# EAGLE design 60_keyboard (EAGLE 9.6.2)
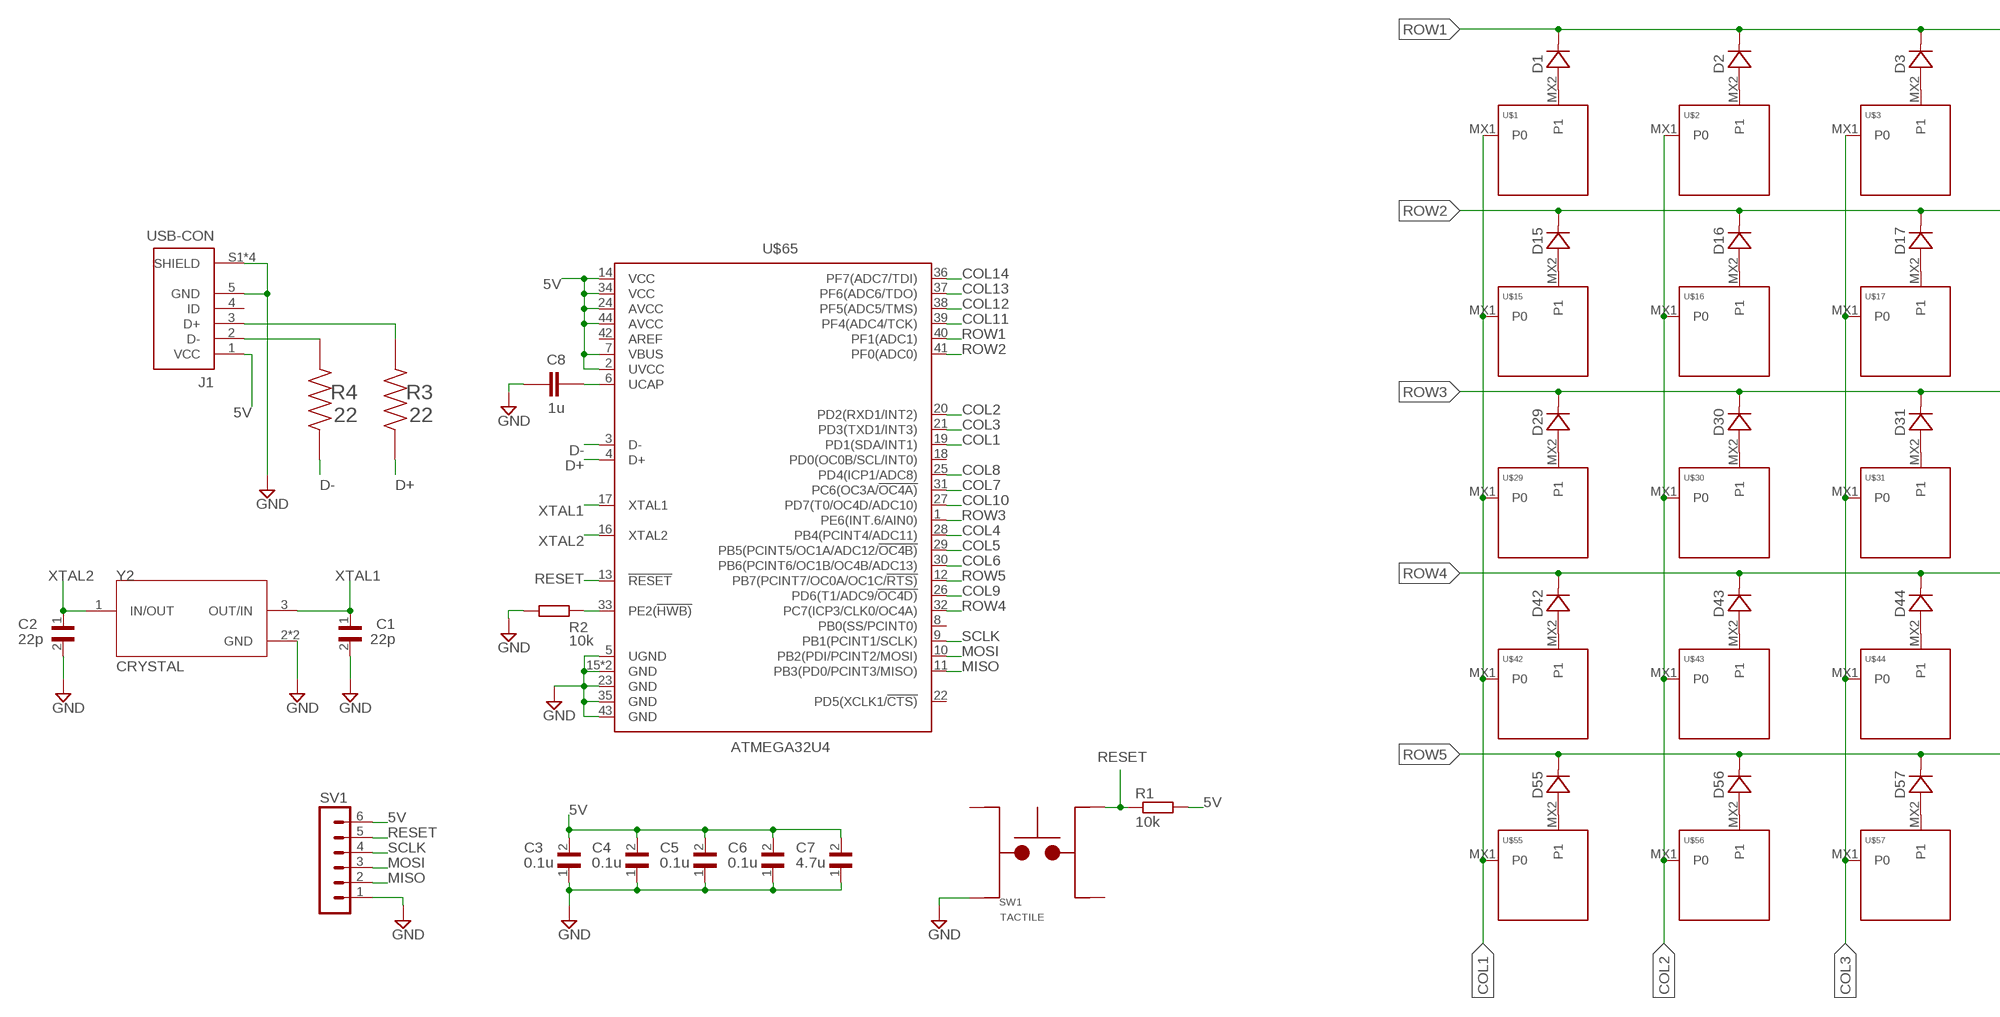
[diagram p0: schematic, sheet 1, part 1 of 2]
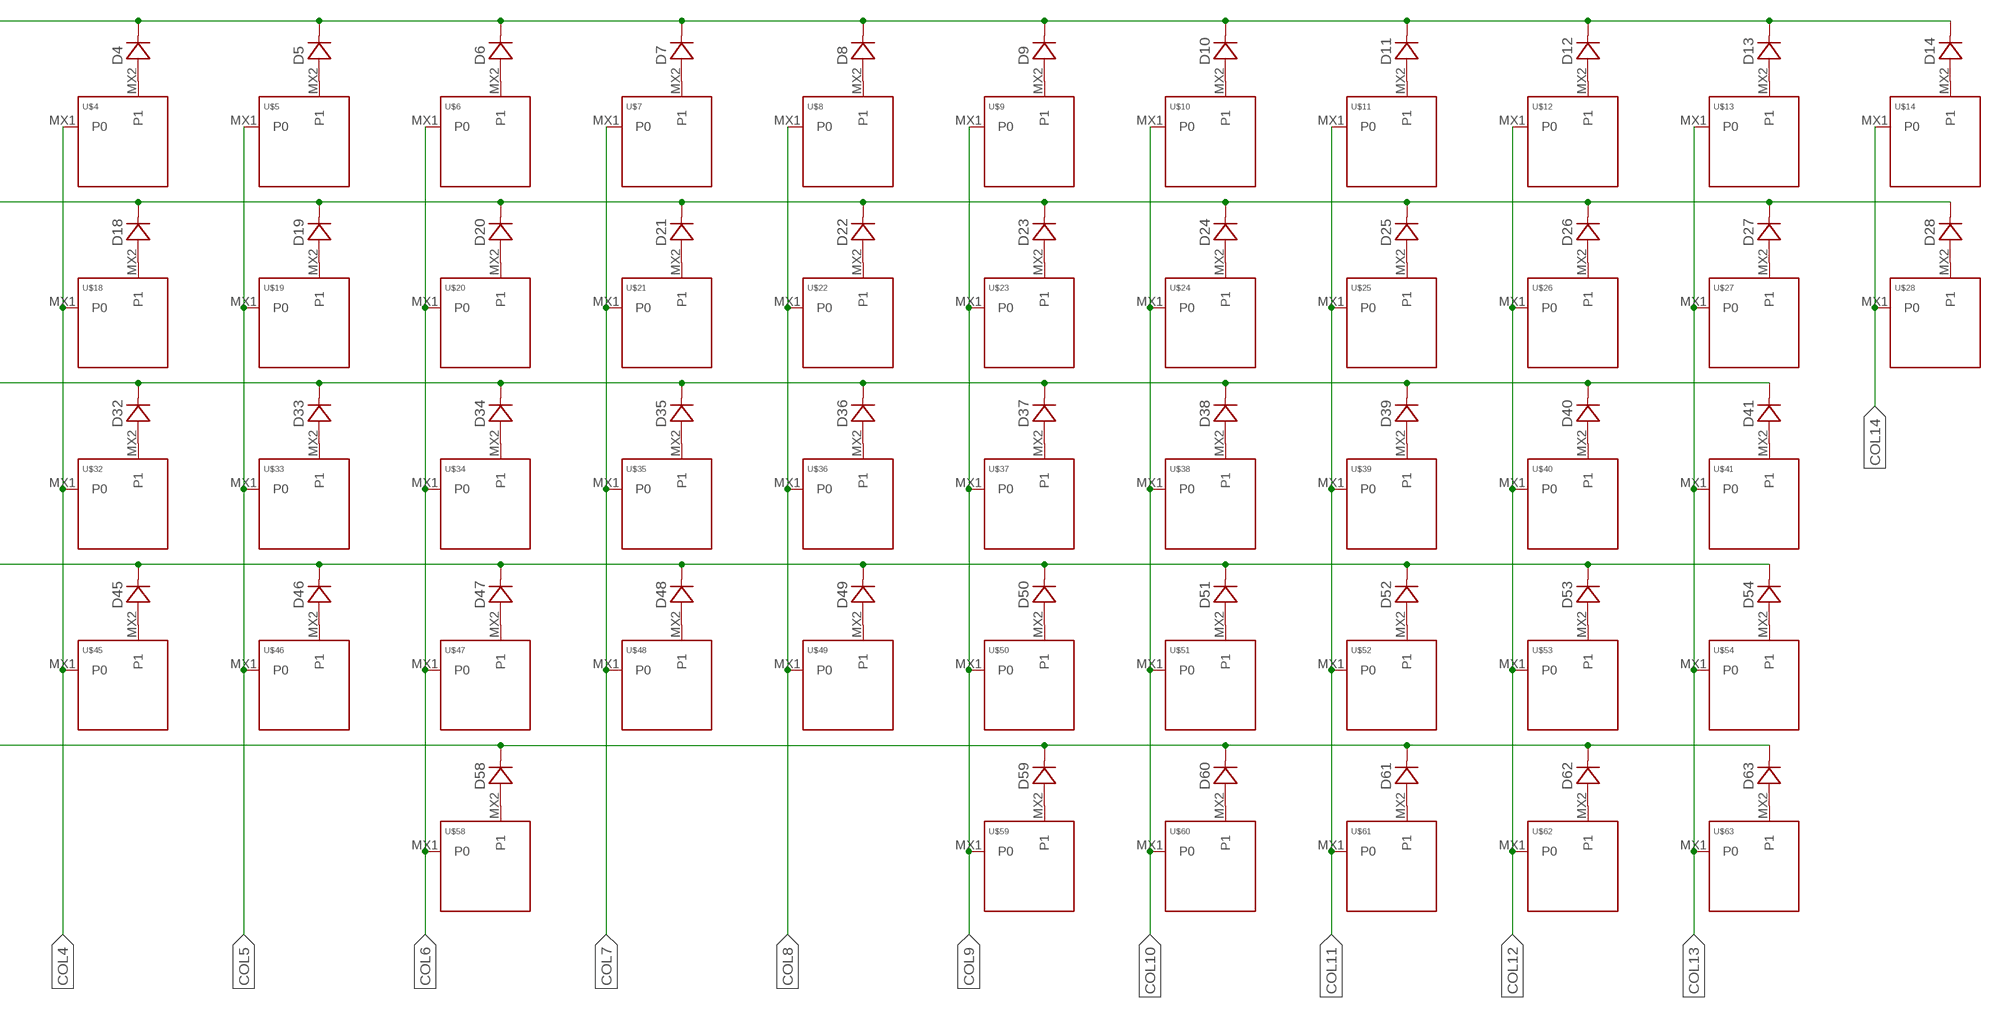
[diagram p1: schematic, sheet 1, part 2 of 2]

## Parts
C1  22p  C0805C220J5GACTU  [CAPC2012X140N]
C2  22p  C0805C220J5GACTU  [CAPC2012X140N]
C3  0.1u  08055F104K4T2A  [CAPC2012X140N]
C4  0.1u  08055F104K4T2A  [CAPC2012X140N]
C5  0.1u  08055F104K4T2A  [CAPC2012X140N]
C6  0.1u  08055F104K4T2A  [CAPC2012X140N]
C7  4.7u  CL21A475KAQNNNE  [CAPC2012X140N]
C8  1u  CAPACITOR-C0805  [C0805]
D1  DIODE-SOD-123  [SOD-123]
D2  DIODE-SOD-123  [SOD-123]
D3  DIODE-SOD-123  [SOD-123]
D4  DIODE-SOD-123  [SOD-123]
D5  DIODE-SOD-123  [SOD-123]
D6  DIODE-SOD-123  [SOD-123]
D7  DIODE-SOD-123  [SOD-123]
D8  DIODE-SOD-123  [SOD-123]
D9  DIODE-SOD-123  [SOD-123]
D10  DIODE-SOD-123  [SOD-123]
D11  DIODE-SOD-123  [SOD-123]
D12  DIODE-SOD-123  [SOD-123]
D13  DIODE-SOD-123  [SOD-123]
D14  DIODE-SOD-123  [SOD-123]
D15  DIODE-SOD-123  [SOD-123]
D16  DIODE-SOD-123  [SOD-123]
D17  DIODE-SOD-123  [SOD-123]
D18  DIODE-SOD-123  [SOD-123]
D19  DIODE-SOD-123  [SOD-123]
D20  DIODE-SOD-123  [SOD-123]
D21  DIODE-SOD-123  [SOD-123]
D22  DIODE-SOD-123  [SOD-123]
D23  DIODE-SOD-123  [SOD-123]
D24  DIODE-SOD-123  [SOD-123]
D25  DIODE-SOD-123  [SOD-123]
D26  DIODE-SOD-123  [SOD-123]
D27  DIODE-SOD-123  [SOD-123]
D28  DIODE-SOD-123  [SOD-123]
D29  DIODE-SOD-123  [SOD-123]
D30  DIODE-SOD-123  [SOD-123]
D31  DIODE-SOD-123  [SOD-123]
D32  DIODE-SOD-123  [SOD-123]
D33  DIODE-SOD-123  [SOD-123]
D34  DIODE-SOD-123  [SOD-123]
D35  DIODE-SOD-123  [SOD-123]
D36  DIODE-SOD-123  [SOD-123]
D37  DIODE-SOD-123  [SOD-123]
D38  DIODE-SOD-123  [SOD-123]
D39  DIODE-SOD-123  [SOD-123]
D40  DIODE-SOD-123  [SOD-123]
D41  DIODE-SOD-123  [SOD-123]
D42  DIODE-SOD-123  [SOD-123]
D43  DIODE-SOD-123  [SOD-123]
D44  DIODE-SOD-123  [SOD-123]
D45  DIODE-SOD-123  [SOD-123]
D46  DIODE-SOD-123  [SOD-123]
D47  DIODE-SOD-123  [SOD-123]
D48  DIODE-SOD-123  [SOD-123]
D49  DIODE-SOD-123  [SOD-123]
D50  DIODE-SOD-123  [SOD-123]
D51  DIODE-SOD-123  [SOD-123]
D52  DIODE-SOD-123  [SOD-123]
D53  DIODE-SOD-123  [SOD-123]
D54  DIODE-SOD-123  [SOD-123]
D55  DIODE-SOD-123  [SOD-123]
D56  DIODE-SOD-123  [SOD-123]
D57  DIODE-SOD-123  [SOD-123]
D58  DIODE-SOD-123  [SOD-123]
D59  DIODE-SOD-123  [SOD-123]
D60  DIODE-SOD-123  [SOD-123]
D61  DIODE-SOD-123  [SOD-123]
D62  DIODE-SOD-123  [SOD-123]
D63  DIODE-SOD-123  [SOD-123]
J1  USB-CON  690-005-299-043  [EDAC_690-005-299-043]
R1  10k  RESISTOR-0805  [R0805]
R2  10k  RESISTOR-0805  [R0805]
R3  22  RMCF0805JT22R0  [RESC2012X65N]
R4  22  RMCF0805JT22R0  [RESC2012X65N]
SV1  MA06-1  [MA06-1]
SW1  TACTILE  TL3342F160QG/TR  [SW_TL3342F160QG/TR]
U$1  KEYSWITCH-PLAIN-MXHSPCB-1U  [MXHSPCB-1U]
U$2  KEYSWITCH-PLAIN-MXHSPCB-1U  [MXHSPCB-1U]
U$3  KEYSWITCH-PLAIN-MXHSPCB-1U  [MXHSPCB-1U]
U$4  KEYSWITCH-PLAIN-MXHSPCB-1U  [MXHSPCB-1U]
U$5  KEYSWITCH-PLAIN-MXHSPCB-1U  [MXHSPCB-1U]
U$6  KEYSWITCH-PLAIN-MXHSPCB-1U  [MXHSPCB-1U]
U$7  KEYSWITCH-PLAIN-MXHSPCB-1U  [MXHSPCB-1U]
U$8  KEYSWITCH-PLAIN-MXHSPCB-1U  [MXHSPCB-1U]
U$9  KEYSWITCH-PLAIN-MXHSPCB-1U  [MXHSPCB-1U]
U$10  KEYSWITCH-PLAIN-MXHSPCB-1U  [MXHSPCB-1U]
U$11  KEYSWITCH-PLAIN-MXHSPCB-1U  [MXHSPCB-1U]
U$12  KEYSWITCH-PLAIN-MXHSPCB-1U  [MXHSPCB-1U]
U$13  KEYSWITCH-PLAIN-MXHSPCB-1U  [MXHSPCB-1U]
U$14  KEYSWITCH-PLAIN-MXHSPCB-2U  [MXHSPCB-2U]
U$15  KEYSWITCH-PLAIN-MXHSPCB-1U  [MXHSPCB-1U]
U$16  KEYSWITCH-PLAIN-MXHSPCB-1U  [MXHSPCB-1U]
U$17  KEYSWITCH-PLAIN-MXHSPCB-1U  [MXHSPCB-1U]
U$18  KEYSWITCH-PLAIN-MXHSPCB-1U  [MXHSPCB-1U]
U$19  KEYSWITCH-PLAIN-MXHSPCB-1U  [MXHSPCB-1U]
U$20  KEYSWITCH-PLAIN-MXHSPCB-1U  [MXHSPCB-1U]
U$21  KEYSWITCH-PLAIN-MXHSPCB-1U  [MXHSPCB-1U]
U$22  KEYSWITCH-PLAIN-MXHSPCB-1U  [MXHSPCB-1U]
U$23  KEYSWITCH-PLAIN-MXHSPCB-1U  [MXHSPCB-1U]
U$24  KEYSWITCH-PLAIN-MXHSPCB-1U  [MXHSPCB-1U]
U$25  KEYSWITCH-PLAIN-MXHSPCB-1U  [MXHSPCB-1U]
U$26  KEYSWITCH-PLAIN-MXHSPCB-1U  [MXHSPCB-1U]
U$27  KEYSWITCH-PLAIN-MXHSPCB-1U  [MXHSPCB-1U]
U$28  KEYSWITCH-PLAIN-MXHSPCB-1U  [MXHSPCB-1U]
U$29  KEYSWITCH-PLAIN-MXHSPCB-1U  [MXHSPCB-1U]
U$30  KEYSWITCH-PLAIN-MXHSPCB-1U  [MXHSPCB-1U]
U$31  KEYSWITCH-PLAIN-MXHSPCB-1U  [MXHSPCB-1U]
U$32  KEYSWITCH-PLAIN-MXHSPCB-1U  [MXHSPCB-1U]
U$33  KEYSWITCH-PLAIN-MXHSPCB-1U  [MXHSPCB-1U]
U$34  KEYSWITCH-PLAIN-MXHSPCB-1U  [MXHSPCB-1U]
U$35  KEYSWITCH-PLAIN-MXHSPCB-1U  [MXHSPCB-1U]
U$36  KEYSWITCH-PLAIN-MXHSPCB-1U  [MXHSPCB-1U]
U$37  KEYSWITCH-PLAIN-MXHSPCB-1U  [MXHSPCB-1U]
U$38  KEYSWITCH-PLAIN-MXHSPCB-1U  [MXHSPCB-1U]
U$39  KEYSWITCH-PLAIN-MXHSPCB-1U  [MXHSPCB-1U]
U$40  KEYSWITCH-PLAIN-MXHSPCB-1U  [MXHSPCB-1U]
U$41  KEYSWITCH-PLAIN-MXHSPCB-2U  [MXHSPCB-2U]
U$42  KEYSWITCH-PLAIN-MXHSPCB-2U  [MXHSPCB-2U]
U$43  KEYSWITCH-PLAIN-MXHSPCB-1U  [MXHSPCB-1U]
U$44  KEYSWITCH-PLAIN-MXHSPCB-1U  [MXHSPCB-1U]
U$45  KEYSWITCH-PLAIN-MXHSPCB-1U  [MXHSPCB-1U]
U$46  KEYSWITCH-PLAIN-MXHSPCB-1U  [MXHSPCB-1U]
U$47  KEYSWITCH-PLAIN-MXHSPCB-1U  [MXHSPCB-1U]
U$48  KEYSWITCH-PLAIN-MXHSPCB-1U  [MXHSPCB-1U]
U$49  KEYSWITCH-PLAIN-MXHSPCB-1U  [MXHSPCB-1U]
U$50  KEYSWITCH-PLAIN-MXHSPCB-1U  [MXHSPCB-1U]
U$51  KEYSWITCH-PLAIN-MXHSPCB-1U  [MXHSPCB-1U]
U$52  KEYSWITCH-PLAIN-MXHSPCB-1U  [MXHSPCB-1U]
U$53  KEYSWITCH-PLAIN-MXHSPCB-1U  [MXHSPCB-1U]
U$54  KEYSWITCH-PLAIN-MXHSPCB-1U  [MXHSPCB-1U]
U$55  KEYSWITCH-PLAIN-MXHSPCB-1U  [MXHSPCB-1U]
U$56  KEYSWITCH-PLAIN-MXHSPCB-1U  [MXHSPCB-1U]
U$57  KEYSWITCH-PLAIN-MXHSPCB-1U  [MXHSPCB-1U]
U$58  KEYSWITCH-PLAIN-MXHSPCB-6.25U-FLIPPED  [MXHSPCB-6.25U-FLIPPED]
U$59  KEYSWITCH-PLAIN-MXHSPCB-1U  [MXHSPCB-1U]
U$60  KEYSWITCH-PLAIN-MXHSPCB-1U  [MXHSPCB-1U]
U$61  KEYSWITCH-PLAIN-MXHSPCB-1U  [MXHSPCB-1U]
U$62  KEYSWITCH-PLAIN-MXHSPCB-1U  [MXHSPCB-1U]
U$63  KEYSWITCH-PLAIN-MXHSPCB-1U  [MXHSPCB-1U]
U$65  ATMEGA32U4  ATMEGA32U4-QFN44  [QFN-44]
Y2  CRYSTAL  ECS-160-12-33-AGN-TR  [XTAL_ECS-160-12-33-AGN-TR]

## Nets
5V: C3.2 C4.2 C5.2 C6.2 C7.2 J1.1(VCC) R1.2 SV1.6 U$65.2(UVCC) U$65.7(VBUS) U$65.14(VCC) U$65.24(AVCC) U$65.34(VCC) U$65.44(AVCC)
COL1: U$1.MX1(P0) U$15.MX1(P0) U$29.MX1(P0) U$42.MX1(P0) U$55.MX1(P0) U$65.19(PD1(SDA/INT1))
COL2: U$2.MX1(P0) U$16.MX1(P0) U$30.MX1(P0) U$43.MX1(P0) U$56.MX1(P0) U$65.20(PD2(RXD1/INT2))
COL3: U$3.MX1(P0) U$17.MX1(P0) U$31.MX1(P0) U$44.MX1(P0) U$57.MX1(P0) U$65.21(PD3(TXD1/INT3))
COL4: U$4.MX1(P0) U$18.MX1(P0) U$32.MX1(P0) U$45.MX1(P0) U$65.28(PB4(PCINT4/ADC11))
COL5: U$5.MX1(P0) U$19.MX1(P0) U$33.MX1(P0) U$46.MX1(P0) U$65.29(PB5(PCINT5/OC1A/ADC12/!OC4B))
COL6: U$6.MX1(P0) U$20.MX1(P0) U$34.MX1(P0) U$47.MX1(P0) U$58.MX1(P0) U$65.30(PB6(PCINT6/OC1B/OC4B/ADC13))
COL7: U$7.MX1(P0) U$21.MX1(P0) U$35.MX1(P0) U$48.MX1(P0) U$65.31(PC6(OC3A/!OC4A))
COL8: U$8.MX1(P0) U$22.MX1(P0) U$36.MX1(P0) U$49.MX1(P0) U$65.25(PD4(ICP1/ADC8))
COL9: U$9.MX1(P0) U$23.MX1(P0) U$37.MX1(P0) U$50.MX1(P0) U$59.MX1(P0) U$65.26(PD6(T1/ADC9/!OC4D))
COL10: U$10.MX1(P0) U$24.MX1(P0) U$38.MX1(P0) U$51.MX1(P0) U$60.MX1(P0) U$65.27(PD7(T0/OC4D/ADC10))
COL11: U$11.MX1(P0) U$25.MX1(P0) U$39.MX1(P0) U$52.MX1(P0) U$61.MX1(P0) U$65.39(PF4(ADC4/TCK))
COL12: U$12.MX1(P0) U$26.MX1(P0) U$40.MX1(P0) U$53.MX1(P0) U$62.MX1(P0) U$65.38(PF5(ADC5/TMS))
COL13: U$13.MX1(P0) U$27.MX1(P0) U$41.MX1(P0) U$54.MX1(P0) U$63.MX1(P0) U$65.37(PF6(ADC6/TDO))
COL14: U$14.MX1(P0) U$28.MX1(P0) U$65.36(PF7(ADC7/TDI))
D+: R3.1 U$65.4(D+)
D-: R4.1 U$65.3(D-)
GND: C1.2 C2.2 C3.1 C4.1 C5.1 C6.1 C7.1 C8.2 J1.5(GND) J1.S1(SHIELD) J1.S2(SHIELD) J1.S3(SHIELD) J1.S4(SHIELD) R2.1 SV1.1 SW1.3 U$65.5(UGND) U$65.15(GND) U$65.23(GND) U$65.35(GND) U$65.43(GND) U$65.TAB(GND) Y2.2(GND) Y2.4(GND)
MISO: SV1.2 U$65.11(PB3(PD0/PCINT3/MISO))
MOSI: SV1.3 U$65.10(PB2(PDI/PCINT2/MOSI))
N$1: D1.A U$1.MX2(P1)
N$2: D2.A U$2.MX2(P1)
N$3: D3.A U$3.MX2(P1)
N$4: D4.A U$4.MX2(P1)
N$5: D5.A U$5.MX2(P1)
N$6: D6.A U$6.MX2(P1)
N$7: D7.A U$7.MX2(P1)
N$8: D8.A U$8.MX2(P1)
N$9: D9.A U$9.MX2(P1)
N$10: D10.A U$10.MX2(P1)
N$11: D11.A U$11.MX2(P1)
N$12: D12.A U$12.MX2(P1)
N$13: D13.A U$13.MX2(P1)
N$14: D14.A U$14.MX2(P1)
N$15: D15.A U$15.MX2(P1)
N$16: D16.A U$16.MX2(P1)
N$17: D17.A U$17.MX2(P1)
N$18: D18.A U$18.MX2(P1)
N$19: D19.A U$19.MX2(P1)
N$20: D20.A U$20.MX2(P1)
N$21: D21.A U$21.MX2(P1)
N$22: D22.A U$22.MX2(P1)
N$23: D23.A U$23.MX2(P1)
N$24: D24.A U$24.MX2(P1)
N$25: D25.A U$25.MX2(P1)
N$26: D26.A U$26.MX2(P1)
N$27: D27.A U$27.MX2(P1)
N$28: D28.A U$28.MX2(P1)
N$29: D29.A U$29.MX2(P1)
N$30: D30.A U$30.MX2(P1)
N$31: D31.A U$31.MX2(P1)
N$32: D32.A U$32.MX2(P1)
N$33: D33.A U$33.MX2(P1)
N$34: D34.A U$34.MX2(P1)
N$35: D35.A U$35.MX2(P1)
N$36: D36.A U$36.MX2(P1)
N$37: D37.A U$37.MX2(P1)
N$38: D38.A U$38.MX2(P1)
N$39: D39.A U$39.MX2(P1)
N$40: D40.A U$40.MX2(P1)
N$41: D41.A U$41.MX2(P1)
N$42: D42.A U$42.MX2(P1)
N$43: D43.A U$43.MX2(P1)
N$44: D44.A U$44.MX2(P1)
N$45: D45.A U$45.MX2(P1)
N$46: D46.A U$46.MX2(P1)
N$47: D47.A U$47.MX2(P1)
N$48: D48.A U$48.MX2(P1)
N$49: D49.A U$49.MX2(P1)
N$50: D50.A U$50.MX2(P1)
N$51: D51.A U$51.MX2(P1)
N$52: D52.A U$52.MX2(P1)
N$53: D53.A U$53.MX2(P1)
N$54: D54.A U$54.MX2(P1)
N$55: D58.A U$58.MX2(P1)
N$56: D55.A U$55.MX2(P1)
N$57: D56.A U$56.MX2(P1)
N$58: D57.A U$57.MX2(P1)
N$59: J1.2(D-) R4.2
N$60: D59.A U$59.MX2(P1)
N$61: D60.A U$60.MX2(P1)
N$62: D61.A U$61.MX2(P1)
N$63: D62.A U$62.MX2(P1)
N$64: D63.A U$63.MX2(P1)
N$65: J1.3(D+) R3.2
N$68: R2.2 U$65.33(PE2(!HWB))
N$71: C8.1 U$65.6(UCAP)
RESET: R1.1 SV1.5 SW1.2 U$65.13(!RESET)
ROW1: D1.C D2.C D3.C D4.C D5.C D6.C D7.C D8.C D9.C D10.C D11.C D12.C D13.C D14.C U$65.40(PF1(ADC1))
ROW2: D15.C D16.C D17.C D18.C D19.C D20.C D21.C D22.C D23.C D24.C D25.C D26.C D27.C D28.C U$65.41(PF0(ADC0))
ROW3: D29.C D30.C D31.C D32.C D33.C D34.C D35.C D36.C D37.C D38.C D39.C D40.C D41.C U$65.1(PE6(INT.6/AIN0))
ROW4: D42.C D43.C D44.C D45.C D46.C D47.C D48.C D49.C D50.C D51.C D52.C D53.C D54.C U$65.32(PC7(ICP3/CLK0/OC4A))
ROW5: D55.C D56.C D57.C D58.C D59.C D60.C D61.C D62.C D63.C U$65.12(PB7(PCINT7/OC0A/OC1C/!RTS))
SCLK: SV1.4 U$65.9(PB1(PCINT1/SCLK))
XTAL1: C1.1 U$65.17(XTAL1) Y2.3(OUT/IN)
XTAL2: C2.1 U$65.16(XTAL2) Y2.1(IN/OUT)
Unconnected: J1.4(ID) SW1.1 SW1.4 U$65.8(PB0(SS/PCINT0)) U$65.18(PD0(OC0B/SCL/INT0)) U$65.22(PD5(XCLK1/!CTS)) U$65.42(AREF)

## Library data of the parts
C1 C2 = C0805C220J5GACTU:C0805C220J5GACTU: SMD 0805 CERAMIC NPO -55^+125 22 PF +/-5? 50V; DESCRIPTION: 22 pF ±5% 50V Ceramic Capacitor C0G, NP0 0805 (2012 Metric); DIGI-KEY_PART_NUMBER: 399-C0805C220J5GAC7800CT-ND; MF: KEMET; MP: C0805C220J5GACTU; PACKAGE: 0805 Kemet; PURCHASE-URL: https://pricing.snapeda.com/search/part/C0805C220J5GACTU/?ref=eda
C3-C6 = 08055F104K4T2A:08055F104K4T2A: 0805 100 nF 50 V ±10 % Tolerance X8R SMT Multilayer Ceramic Capacitor; DESCRIPTION: 0.1 µF ±10% 50V Ceramic Capacitor X8R 0805 (2012 Metric); DIGI-KEY_PART_NUMBER: 478-3614-2-ND; MF: AVX; MP: 08055F104K4T2A; PACKAGE: 2012 AVX; PURCHASE-URL: https://pricing.snapeda.com/search/part/08055F104K4T2A/?ref=eda
C7 = CL21A475KAQNNNE:CL21A475KAQNNNE: CL21 Series 4.7 uF 25 V ±10 % Tolerance X5R SMT Multilayer Ceramic Capacitor; DESCRIPTION: 4.7 µF ±10% 25V Ceramic Capacitor X5R 0805 (2012 Metric); DIGI-KEY_PART_NUMBER: 1276-1244-1-ND; MF: Samsung Electro-Mechanics; MP: CL21A475KAQNNNE; PACKAGE: 0805 Samsung; PURCHASE-URL: https://pricing.snapeda.com/search/part/CL21A475KAQNNNE/?ref=eda
C8 = Components:CAPACITOR
D1-D63 = Components:DIODE: Standard 1N4148 diode
J1 = 690-005-299-043:690-005-299-043: USB - mini B USB 2.0 Receptacle Connector 5 Position Surface Mount, Right Angle; DESCRIPTION: USB - mini B USB 2.0 Receptacle Connector 5 Position Surface Mount, Right Angle; DIGI-KEY_PART_NUMBER: 151-1206-2-ND; MF: EDAC Inc.; MP: 690-005-299-043; PACKAGE: None; PURCHASE-URL: https://pricing.snapeda.com/search/part/690-005-299-043/?ref=eda
R1 R2 = Components:RESISTOR
R3 R4 = RMCF0805JT22R0:RMCF0805JT22R0; DESCRIPTION: 22 Ohms ±5% 0.125W, 1/8W Chip Resistor 0805 (2012 Metric) Automotive AEC-Q200 Thick Film; DIGI-KEY_PART_NUMBER: RMCF0805JT22R0TR-ND; MF: Stackpole Electronics Inc; MP: RMCF0805JT22R0; PACKAGE: 2012 Stackpole; PURCHASE-URL: https://pricing.snapeda.com/search/part/RMCF0805JT22R0/?ref=eda
SV1 = con-lstb:MA06-1: PIN HEADER; OC_FARNELL: unknown; OC_NEWARK: unknown
SW1 = TL3342F160QG_TR:TL3342F160QG/TR: TL3342 Series SPST 1.6 N Round Button Gull Wing Surface Mount Tactile Switch; DESCRIPTION: Tactile Switch SPST-NO Top Actuated Surface Mount; DIGI-KEY_PART_NUMBER: EG2531CT-ND; MF: E-Switch; MP: TL3342F160QG/TR; PACKAGE: None; PURCHASE-URL: https://pricing.snapeda.com/search/part/TL3342F160QG/TR/?ref=eda
U$1-U$63 = Keyboard:KEYSWITCH-PLAIN
U$65 = MCU:ATMEGA32U4
Y2 = ECS-160-12-33-AGN-TR:ECS-160-12-33-AGN-TR; DESCRIPTION: 16 MHz ±25ppm Crystal 12pF 80 Ohms 4-SMD, No Lead; DIGI-KEY_PART_NUMBER: XC2930TR-ND; MF: ECS Inc.; MP: ECS-160-12-33-AGN-TR; PACKAGE: SMD-4 ECS International; PURCHASE-URL: https://pricing.snapeda.com/search/part/ECS-160-12-33-AGN-TR/?ref=eda

## Board
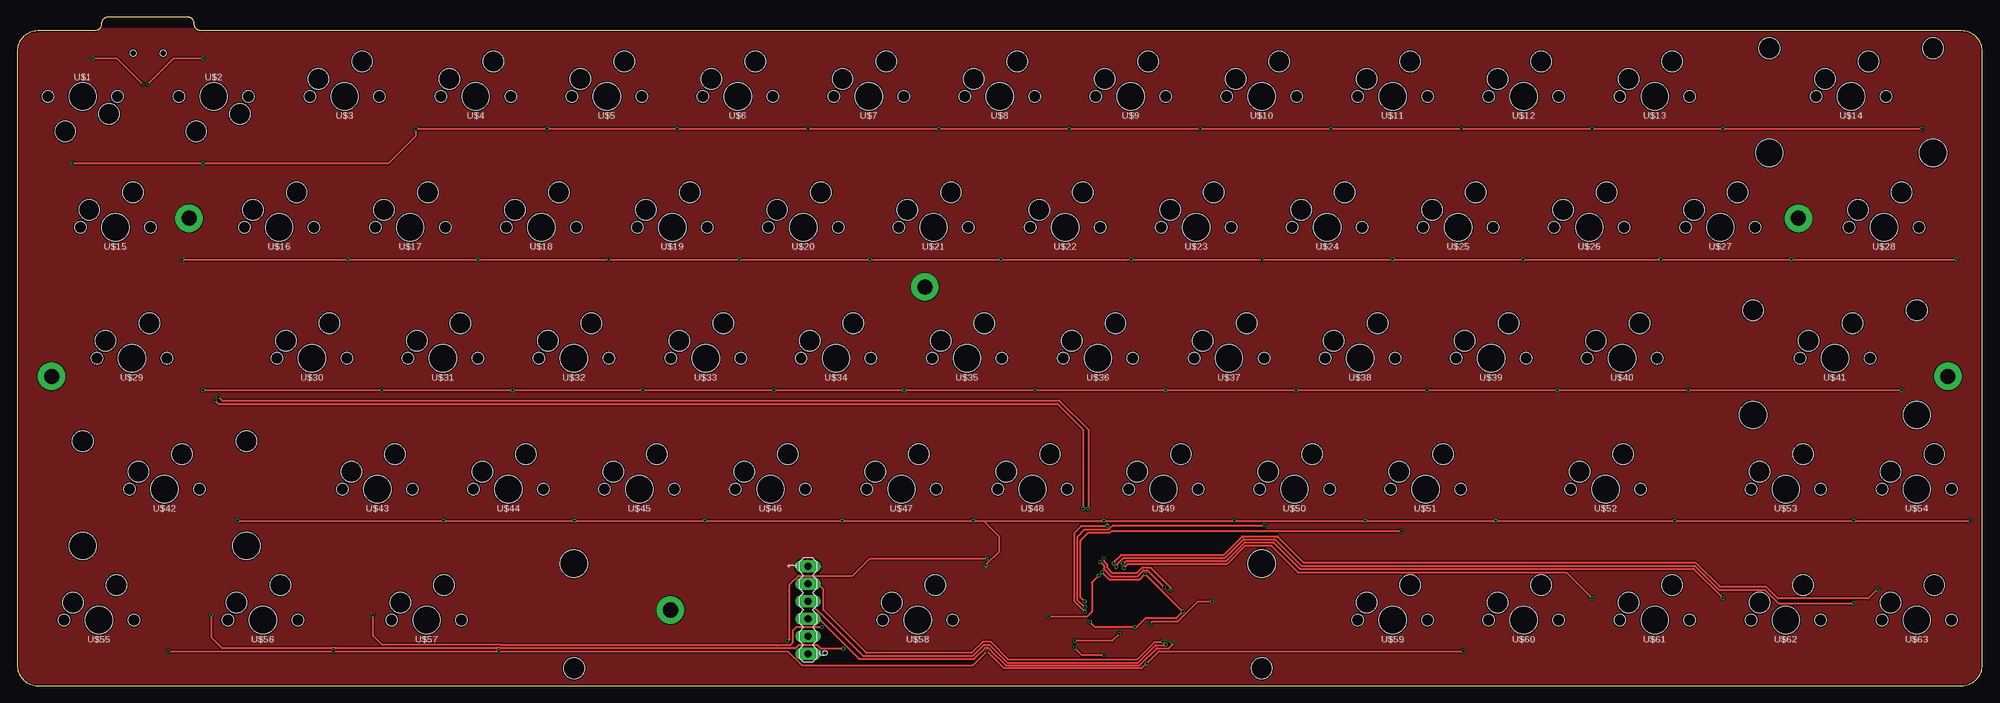
[diagram p2: board, top side]
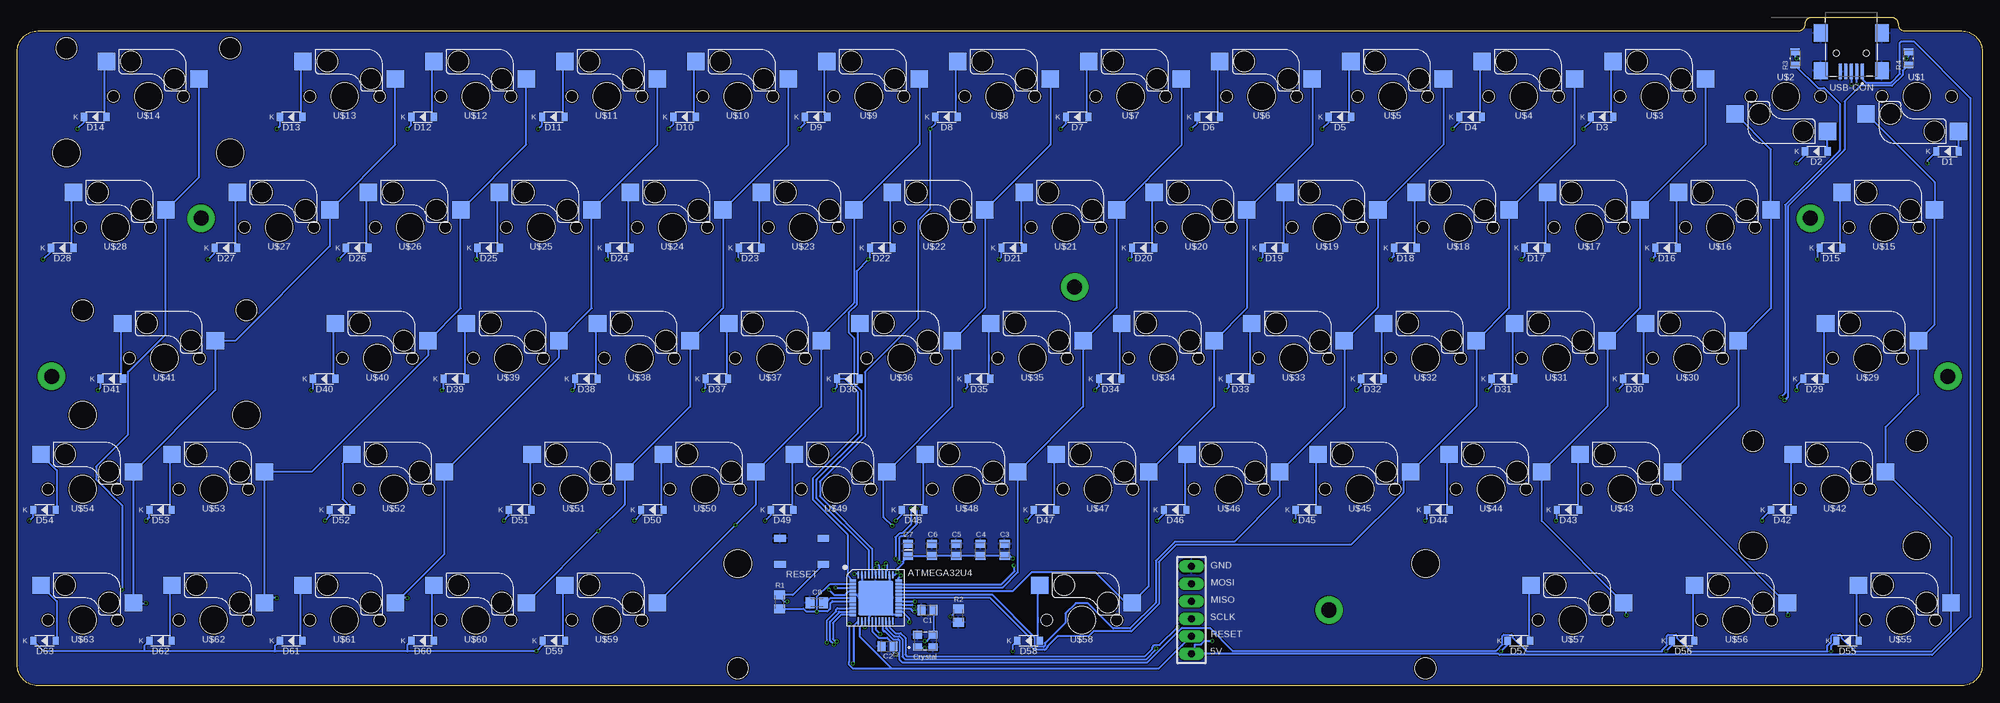
[diagram p3: board, bottom side, seen from below]

Size 285.75 x 97.25 mm. Coordinates in mm from the lower left corner, seen from the top.
Outline: 3,0 282.75,0 arc90 285.75,3 285.75,92.25 arc90 282.75,95.25 26.75,95.25 arc-90 25.75,96.25 arc90 24.75,97.25 13.25,97.25 arc90 12.25,96.25 arc-90 11.25,95.25 3,95.25 arc90 0,92.25 0,3 arc90 3,0
Copper layers (1*16): Top 0.035mm / dielectric 1.6mm / Bottom 0.035mm
Design rules "jlcpcb-2layers": minimum track width 5mil, minimum drill 0.3mm, track to track 5mil, track to pad 5mil, pad to pad 5mil, via to via 5mil, smd to smd 5mil, copper to edge 0.2mm, drill to drill 6mil, minimum pad ring 10mil, minimum via ring 3mil, stop-mask expansion 4mil, vias tented up to drill 0mil, thermal gap 10mil

### Footprints (pad centres in the part's own frame; a part is rotated, then mirrored left to right if it is on the bottom)
CAPC2012X140N = smd 1.16 x 1.47: 1 -0.875,0; 2 0.875,0
CAPC2012X140N' = smd 1.16 x 1.47: 1 -0.88,0; 2 0.88,0
CAPC2012X140N'' = smd 1.15 x 1.45: 1 -0.9,0; 2 0.9,0
C0805 = smd 1.3 x 1.6: 1 -1,0; 2 1,0
SOD-123 = smd 0.91 x 1.22: A -1.635,0; C 1.635,0
EDAC_690-005-299-043 = smd 0.5 x 2.3: 1 -1.6,2.65; 2 -0.8,2.65; 3 0,2.65; 4 0.8,2.65; 5 1.6,2.65 | smd 2 x 2.5: S1 -4.45,2.55; S2 4.45,2.55; S3 4.45,-2.95; S4 -4.45,-2.95 | hole 0.9: -2.2,0; 2.2,0
R0805 = smd 1.3 x 1.6: 1 -1,0; 2 1,0
RESC2012X65N = smd 1.01 x 1.38: 1 -0.95,0; 2 0.95,0
MA06-1 = drill 1.016 long: 1 -6.35,0; 2 -3.81,0; 3 -1.27,0; 4 1.27,0; 5 3.81,0; 6 6.35,0
SW_TL3342F160QG/TR = smd 1.7 x 1: 1 -3.15,-1.9; 2 3.15,-1.9; 3 -3.15,1.9; 4 3.15,1.9
MXHSPCB-1U = smd 2.55 x 2.5: MX1 7.36,2.54; MX2 -6.09,5.08 | hole 4: 0,0 | hole 1.7: 5.08,0; -5.08,0 | hole 3: 3.81,2.54; -2.54,5.08
MXHSPCB-2U = smd 2.55 x 2.5: MX1 7.36,2.54; MX2 -6.09,5.08 | hole 4: 0,0; -11.9,-8.24; 11.9,-8.24 | hole 1.7: 5.08,0; -5.08,0 | hole 3: 3.81,2.54; -2.54,5.08 | hole 3.05: -11.9,7; 11.9,7
MXHSPCB-6.25U-FLIPPED = smd 2.55 x 2.5: MX1 7.36,2.54; MX2 -6.09,5.08 | hole 4: 0,0; -50,8.24; 50,8.24 | hole 1.7: 5.08,0; -5.08,0 | hole 3: 3.81,2.54; -2.54,5.08 | hole 3.05: -50,-7; 50,-7
QFN-44 = smd 1 x 0.3: 1 -3.35,2.5; 2 -3.35,2; 3 -3.35,1.5; 4 -3.35,1; 5 -3.35,0.5; 6 -3.35,0; 7 -3.35,-0.5; 8 -3.35,-1; 9 -3.35,-1.5; 10 -3.35,-2; 11 -3.35,-2.5; 23 3.35,-2.5; 24 3.35,-2; 25 3.35,-1.5; 26 3.35,-1; 27 3.35,-0.5; 28 3.35,0; 29 3.35,0.5; 30 3.35,1; 31 3.35,1.5; 32 3.35,2; 33 3.35,2.5 | smd 0.3 x 1: 12 -2.5,-3.35; 13 -2,-3.35; 14 -1.5,-3.35; 15 -1,-3.35; 16 -0.5,-3.35; 17 0,-3.35; 18 0.5,-3.35; 19 1,-3.35; 20 1.5,-3.35; 21 2,-3.35; 22 2.5,-3.35; 34 2.5,3.35; 35 2,3.35; 36 1.5,3.35; 37 1,3.35; 38 0.5,3.35; 39 0,3.35; 40 -0.5,3.35; 41 -1,3.35; 42 -1.5,3.35; 43 -2,3.35; 44 -2.5,3.35 | smd 5.08 x 5.08: TAB 0,0
XTAL_ECS-160-12-33-AGN-TR = smd 1.3 x 1.1: 1 -1.15,-0.9; 2 1.15,-0.9; 3 1.15,0.9; 4 -1.15,0.9

### Placement (x,y rotation side)
C1  153.35,11 180 bottom
C2  159.2,5.75 180 bottom
C3  0.1u  [CAPC2012X140N']  142.15,19.75 270 bottom
C4  0.1u  [CAPC2012X140N']  145.7,19.75 270 bottom
C5  0.1u  [CAPC2012X140N']  149.2,19.75 270 bottom
C6  0.1u  [CAPC2012X140N']  152.7,19.75 270 bottom
C7  4.7u  [CAPC2012X140N'']  156.2,19.75 270 bottom
C8  169.47,12.08 180 bottom
D1  5.05,77.72 180 bottom
D2  24.15,77.72 180 bottom
D3  55.3,82.72 180 bottom
D4  74.4,82.72 180 bottom
D5  93.4,82.72 180 bottom
D6  112.5,82.72 180 bottom
D7  131.6,82.72 180 bottom
D8  150.6,82.72 180 bottom
D9  169.6,82.72 180 bottom
D10  188.7,82.72 180 bottom
D11  207.8,82.72 180 bottom
D12  226.8,82.72 180 bottom
D13  245.9,82.72 180 bottom
D14  274.4,82.72 180 bottom
D15  22,63.67 180 bottom
D16  45.9,63.67 180 bottom
D17  64.9,63.67 180 bottom
D18  83.9,63.67 180 bottom
D19  103,63.67 180 bottom
D20  122,63.67 180 bottom
D21  141,63.67 180 bottom
D22  160.1,63.67 180 bottom
D23  179.2,63.67 180 bottom
D24  198.2,63.67 180 bottom
D25  217.2,63.67 180 bottom
D26  236.3,63.67 180 bottom
D27  255.4,63.67 180 bottom
D28  279.2,63.67 180 bottom
D29  24.4,44.62 180 bottom
D30  50.6,44.62 180 bottom
D31  69.7,44.62 180 bottom
D32  88.7,44.62 180 bottom
D33  107.9,44.62 180 bottom
D34  126.8,44.62 180 bottom
D35  145.9,44.62 180 bottom
D36  164.9,44.62 180 bottom
D37  184,44.62 180 bottom
D38  203,44.62 180 bottom
D39  222.1,44.62 180 bottom
D40  241.1,44.62 180 bottom
D41  272,44.62 180 bottom
D42  29.1,25.57 180 bottom
D43  60.22,25.57 180 bottom
D44  79.1,25.57 180 bottom
D45  98.2,25.57 180 bottom
D46  117.37,25.57 180 bottom
D47  136.3,25.57 180 bottom
D48  155.47,25.57 180 bottom
D49  174.53,25.57 180 bottom
D50  193.4,25.57 180 bottom
D51  212.62,25.57 180 bottom
D52  238.68,25.57 180 bottom
D53  264.9,25.57 180 bottom
D54  281.77,25.57 180 bottom
D55  19.6,6.53 180 bottom
D56  43.5,6.53 180 bottom
D57  67.4,6.53 180 bottom
D58  138.7,6.53 180 bottom
D59  207.7,6.53 180 bottom
D60  226.8,6.53 180 bottom
D61  245.9,6.53 180 bottom
D62  264.9,6.53 180 bottom
D63  281.77,6.53 180 bottom
J1  19.05,92 180 bottom
R1  174.9,12.19 270 bottom
R2  148.9,10.19 90 bottom
R3  27.25,91.25 90 bottom
R4  10.75,91.25 90 bottom
SV1  115,11 270 top
SW1  171.67,19.52 0 bottom
U$1  9.52,85.73 180 bottom
U$2  28.57,85.73 180 bottom
U$3  47.62,85.73 0 bottom
U$4  66.67,85.72 0 bottom
U$5  85.72,85.73 0 bottom
U$6  104.77,85.73 0 bottom
U$7  123.82,85.73 0 bottom
U$8  142.87,85.73 0 bottom
U$9  161.92,85.73 0 bottom
U$10  180.97,85.73 0 bottom
U$11  200.02,85.73 0 bottom
U$12  219.07,85.72 0 bottom
U$13  238.12,85.73 0 bottom
U$14  266.67,85.72 0 bottom
U$15  14.29,66.68 0 bottom
U$16  38.1,66.68 0 bottom
U$17  57.15,66.68 0 bottom
U$18  76.2,66.68 0 bottom
U$19  95.25,66.68 0 bottom
U$20  114.3,66.67 0 bottom
U$21  133.25,66.68 0 bottom
U$22  152.4,66.68 0 bottom
U$23  171.45,66.68 0 bottom
U$24  190.5,66.68 0 bottom
U$25  209.55,66.68 0 bottom
U$26  228.6,66.68 0 bottom
U$27  247.65,66.68 0 bottom
U$28  271.46,66.68 0 bottom
U$29  16.67,47.62 0 bottom
U$30  42.86,47.62 0 bottom
U$31  61.91,47.62 0 bottom
U$32  80.96,47.62 0 bottom
U$33  100.12,47.62 0 bottom
U$34  119.06,47.62 0 bottom
U$35  138.11,47.62 0 bottom
U$36  157.16,47.62 0 bottom
U$37  176.21,47.62 0 bottom
U$38  195.26,47.62 0 bottom
U$39  214.31,47.62 0 bottom
U$40  233.36,47.62 0 bottom
U$41  264.32,47.62 0 bottom
U$42  21.43,28.58 0 bottom
U$43  52.39,28.58 0 bottom
U$44  71.44,28.58 0 bottom
U$45  90.49,28.58 0 bottom
U$46  109.54,28.58 0 bottom
U$47  128.59,28.58 0 bottom
U$48  147.64,28.58 0 bottom
U$49  166.69,28.58 0 bottom
U$50  185.74,28.58 0 bottom
U$51  204.79,28.58 0 bottom
U$52  230.98,28.58 0 bottom
U$53  257.17,28.58 0 bottom
U$54  276.22,28.58 0 bottom
U$55  11.91,9.53 0 bottom
U$56  35.72,9.53 0 bottom
U$57  59.53,9.53 0 bottom
U$58  130.97,9.53 0 bottom
U$59  200.02,9.53 0 bottom
U$60  219.07,9.53 0 bottom
U$61  238.12,9.53 0 bottom
U$62  257.17,9.53 0 bottom
U$63  276.22,9.53 0 bottom
U$65  160.92,12.78 0 bottom
Y2  153.7,6.5 0 bottom

### Tracks (layer width: path | path; a pad name or v marks a point on that pad's centre or on a via)
5V  (via drill 0.35)
  Top 0.305: v156,9.25 156.75,8.5 v162.5,8.5 162.75,8.5 164.03,9.78 168.5,9.78 v169.5,10.78 169.47,10.78 v164,16.25 163.25,15.5 158.75,15.5 v157.75,16.5 | v141,18.5 124,18.5 121.5,16 113.59,16 112.32,14.73 112.32,6.82 v112,6.5
  Bottom 0.305: J1.1 17.36,89.26 17.36,88.14 16.97,87.75 13.25,87.75 12,89 12,93.5 11.75,93.75 10,93.75 1.75,85.5 1.75,10 7.28,4.47 70.22,4.47 70.4,4.65 SV1.6 114.5,5.15 114.5,6 113.59,6 113.09,6.5 v112,6.5 | R1.2 171.42,11.19 171.01,10.78 v169.5,10.78 | U$65.7 167.22,12.28 167.54,11.96 167.54,11.17 167.93,10.78 v169.5,10.78 | v162.5,8.5 162.42,8.58 U$65.14 | U$65.2 167.62,14.78 169.5,12.9 v169.5,10.78 | U$65.44 163.54,16.25 v164,16.25 | v156,9.25 156,9.75 157,10.75 157.54,10.75 U$65.24 | U$65.34 158.12,16.12 v157.75,16.5 157.75,17 156.97,17.78 156.97,18.08 C7.2 152.72,18.85 C6.2 C5.2 C4.2 C3.2 141.37,18.87 v141,18.5
COL1
  Bottom 0.305: U$1.MX1 16.86,83.19 6.93,73.25 U$15.MX1 6.93,52.52 9.28,50.16 U$29.MX1 9.31,42.43 14.07,37.66 U$42.MX1 14.05,31.12 4.55,21.62 U$55.MX1 4.55,7.82 7.36,5 18.5,5 20.5,7 20.5,7.25 20.66,7.41 21.81,7.41 21.97,7.25 21.97,6.4 22.53,5.84 22.53,5 42.4,5 44.4,7 44.4,7.25 44.56,7.41 45.71,7.41 45.87,7.25 45.87,5.88 46.53,5.22 46.53,5 66.25,5 68.3,7.05 68.3,7.25 68.46,7.41 69.61,7.41 69.77,7.25 69.77,6 70.69,5.08 109.04,5.08 112.34,8.38 113.25,8.38 116.41,8.38 121.36,3.43 157.11,3.43 157.5,3.83 157.5,4.87 157.47,4.9 157.47,6.6 157.63,6.76 158.4,6.76 159.57,7.93 159.75,7.93 159.92,8.1 U$65.19
COL2  (via drill 0.35)
  Top 0.305: v28.25,10.25 28.25,7 29.82,5.43 45.68,5.43 45.78,5.53 46.22,5.53 46.32,5.43 69.68,5.43 69.78,5.53 70.22,5.53 70.32,5.43 113.18,5.43 113.59,5.84 116.41,5.84 116.86,5.4 v120.15,5.4
  Bottom 0.305: 28.5,12.07 28.6,12.07 45.03,28.5 U$43.MX1 45,31.12 35.5,40.62 U$30.MX1 35.48,50.16 30.74,54.9 U$16.MX1 30.74,78.02 35.91,83.19 U$2.MX1 | 28.5,12.07 U$56.MX1 | U$65.20 159.42,8.39 159.26,8.24 158.22,7.2 157.45,7.2 157.03,6.78 157.03,4.22 156.68,3.86 121.54,3.86 120.15,5.26 v120.15,5.4 | v28.25,10.25 28.25,11.82 28.5,12.07
COL3  (via drill 0.35)
  Top 0.305: v117.02,8.52 113.27,8.52 112.75,8 112.75,6.25 112.36,5.86 110.61,5.86 110.5,5.86 70.5,5.86 70.4,5.96 53.04,5.96 51.75,7.25 v51.75,10.25
  Bottom 0.305: U$3.MX1 40.26,78.72 49.76,69.22 U$17.MX1 49.79,54.9 54.53,50.16 U$31.MX1 54.55,40.62 64.05,31.12 U$44.MX1 64.08,23.95 52.2,12.07 U$57.MX1 51.75,11.64 v51.75,10.25 | U$65.21 158.92,8.5 158.05,7.63 157.27,7.63 156.6,6.96 156.6,4.5 156.4,4.29 121.75,4.29 120.68,5.37 120.68,5.62 120.37,5.93 119.62,5.93 v117.02,8.52
COL4
  Bottom 0.305: U$4.MX1 59.31,78.72 68.81,69.22 U$18.MX1 68.84,54.9 73.58,50.16 U$32.MX1 73.6,40.62 83.1,31.12 U$45.MX1 84.2,30.04 84.2,28.08 91.78,20.5 117.25,20.5 119.75,18 119.75,11.89 123.75,7.89 129.27,7.89 129.99,7.17 134.47,7.17 135.9,5.75 135.9,5.62 136.31,5.2 137.81,5.2 138.24,5.63 138.24,6.74 144.28,12.78 U$65.28
COL5
  Bottom 0.305: U$5.MX1 78.36,78.72 87.86,69.22 U$19.MX1 87.89,55.01 92.73,50.16 U$33.MX1 92.76,40.51 102.15,31.12 U$46.MX1 102.18,27.5 108.75,20.93 117.43,20.93 120.18,18.18 120.18,12.07 123.93,8.32 126.39,8.32 130.06,12 131.82,12 133.32,10.5 133.32,9.18 136.33,6.17 136.33,5.8 136.49,5.64 137.64,5.64 137.81,5.81 137.81,7.06 144.03,13.28 U$65.29
COL6
  Bottom 0.305: U$6.MX1 97.41,78.72 106.91,69.22 U$20.MX1 106.94,54.9 111.68,50.16 U$34.MX1 111.7,40.62 121.2,31.12 U$47.MX1 121.23,14.42 123.58,12.07 U$58.MX1 124.54,12.07 128.93,16.46 138.29,16.46 141,13.75 157.54,13.75 U$65.30
COL7
  Bottom 0.305: U$7.MX1 116.46,78.62 125.86,69.22 U$21.MX1 125.89,55 130.73,50.16 U$35.MX1 130.75,40.62 140.25,31.12 U$48.MX1 140.28,16.47 142.5,14.25 157.54,14.25 U$65.31
COL8  (via drill 0.35)
  Top 0.305: v155.25,10.75 153.75,12.25 153.75,22.25 154.75,23.25 v158.5,23.25
  Bottom 0.305: U$8.MX1 135.51,78.72 145.01,69.22 U$22.MX1 145.04,54.9 149.78,50.16 U$36.MX1 149.8,40.62 159.3,31.12 U$49.MX1 159.75,30.69 159.75,24.5 v158.5,23.25 | U$65.25 157.54,11.25 155.95,11.25 155.45,10.75 v155.25,10.75
COL9  (via drill 0.35)
  Top 0.305: v155.32,11.47 155.16,11.47 154.18,12.45 154.18,21.18 154.18,21.68 155.22,22.72 158.72,22.72 159.35,23.35 v181.35,23.35
  Bottom 0.305: U$9.MX1 154.56,78.72 164.06,69.22 U$23.MX1 164.09,55.65 168.85,50.89 U$37.MX1 168.85,40.62 178.35,31.12 U$50.MX1 178.38,26.33 v181.35,23.35 192.64,12.06 U$59.MX1 | U$65.26 155.62,11.78 v155.32,11.47
COL10  (via drill 0.35)
  Top 0.305: v155.2,12.24 154.61,12.83 154.61,21 154.68,21.07 154.68,21.18 155.79,22.29 158.9,22.29 159.11,22.5 v201.25,22.5
  Bottom 0.305: U$60.MX1 211.69,12.06 v201.25,22.5 197.43,26.33 U$51.MX1 197.4,31.12 187.9,40.62 U$38.MX1 187.88,50.16 183.14,54.9 U$24.MX1 183.12,69.22 173.61,78.72 U$10.MX1 | U$65.27 155.23,12.28 v155.2,12.24
COL11  (via drill 0.35)
  Top 0.305: v160.89,17.1 161.54,17.75 175.99,17.75 178.62,20.38 182.27,20.38 186.2,16.46 225.29,16.46 v229,12.75
  Bottom 0.305: U$11.MX1 192.66,78.72 202.16,69.22 U$25.MX1 202.19,54.9 206.93,50.16 U$39.MX1 206.95,47.76 223.59,31.12 U$52.MX1 223.62,19.18 230.74,12.07 U$61.MX1 230.08,12.75 v229,12.75 | U$65.39 160.92,17.07 v160.89,17.1
COL12  (via drill 0.35)
  Top 0.305: v160.76,17.75 160.89,17.75 161.32,18.18 175.81,18.18 178.49,20.87 182.69,20.87 186.56,17 243.75,17 v248,12.75
  Bottom 0.305: U$12.MX1 211.71,78.72 221.21,69.22 U$26.MX1 221.24,54.9 225.98,50.16 U$40.MX1 226,48.02 242.91,31.12 U$53.MX1 U$62.MX1 249.13,12.75 v248,12.75 | U$65.38 160.42,16.72 160.36,16.78 160.36,17.35 v160.76,17.75
COL13  (via drill 0.35)
  Top 0.305: v159.83,17.25 159.98,17.4 159.98,17.72 160.87,18.61 175.63,18.61 178.31,21.3 182.87,21.3 186.74,17.43 243.93,17.43 247.44,13.92 254.13,13.92 256.05,12 v267,12
  Bottom 0.305: U$13.MX1 230.76,78.72 240.26,69.22 U$27.MX1 240.29,63.92 254.04,50.16 U$41.MX1 256.96,43 268.84,31.12 U$54.MX1 U$63.MX1 268.8,12 v267,12 | U$65.37 159.92,17.16 v159.83,17.25
COL14  (via drill 0.35)
  Top 0.305: v159.44,17.76 159.44,17.95 160.54,19.05 175.45,19.05 178.13,21.73 183.27,21.73 187.14,17.86 244.11,17.86 247.62,14.35 254.31,14.35 255.98,12.68 269.18,12.68 v270.5,14
  Bottom 0.305: U$14.MX1 259.31,73.98 264.08,69.22 U$28.MX1 264.16,69.16 264.16,51.11 269.63,45.64 269.63,36.52 274.27,31.88 274.27,30.02 272.35,28.1 272.35,28.08 270.5,26.23 v270.5,14 | U$65.36 159.42,16.66 159.3,16.78 159.3,17.76 v159.44,17.76
D+  (via drill 0.35)
  Top 0.305: v29.28,42 29.78,41.5 151.5,41.5 155.75,37.25 v155.75,25.75 | v158.03,18.5 158.03,18.08 158.43,17.68 158.43,17.18 159.18,16.43 162.82,16.43 163.6,17.21 164.79,17.21 167.7,14.3 v167.7,13.95
  Bottom 0.305: R3.1 23.88,86.93 23,86.93 20.75,84.68 20.75,77.86 28.68,69.93 28.68,42.6 v29.28,42 | v155.75,25.75 155.75,23.5 157.07,22.18 157.43,22.18 158.03,21.58 v158.03,18.5 | v167.7,13.95 167,13.25 165.32,13.25 164.86,13.71 164.34,13.71 U$65.4
D-  (via drill 0.35)
  Top 0.305: v28.75,41.5 29.25,41 151.25,41 155,37.25 v155,25.75 | v157.5,18 158,17.5 158,17 159.07,15.93 162.93,15.93 163.78,16.78 164.33,16.78 166.76,14.36 v166.76,14.24
  Bottom 0.305: R4.1 11.57,89.48 11.57,88.82 13.14,87.25 17.75,87.25 20,85 20,78 23.28,74.72 28.25,69.75 28.25,42 v28.75,41.5 | v155,25.75 155,23.5 156.75,21.75 157.25,21.75 157.5,21.5 v157.5,18 | v166.76,14.24 164.3,14.24 U$65.3
GND
  Bottom 0.305: U$65.35 158.92,14.78 U$65.TAB | U$65.43 162.92,14.78 U$65.TAB | U$65.5 164.2,13.21 163.68,13.21 163.25,12.78 U$65.TAB | U$65.15 161.85,9.49 161.85,10.02 160.92,10.95 U$65.TAB | U$65.23 158.47,10.28 158.5,10.25 160.92,12.67 U$65.TAB
  pour Bottom: -0.25,-0.25 286,-0.25 286,95.5 -0.25,95.5
  pour Top: -0.25,-0.25 286.25,-0.25 286.25,95.5 -0.25,95.5
MISO  (via drill 0.35)
  Top 0.305: v166.56,6.45 166.44,6.33 165.35,6.33 162.82,3.79 144.18,3.79 141.58,6.39 140.42,6.39 138.78,4.75 123.5,4.75 117.25,11 117.25,14 116.44,14.81 SV1.2
  Bottom 0.305: U$65.11 165.97,10.28 167.14,9.11 167.14,6.75 166.92,6.53 166.78,6.53 166.69,6.45 v166.56,6.45
MOSI  (via drill 0.35)
  Top 0.305: SV1.3 116.35,10.92 116.41,10.92 117.11,10.22 117.11,10.21 123,4.32 138.96,4.32 140.6,5.96 141.4,5.96 144,3.36 163,3.36 165.53,5.89 166.89,5.89 v167,6
  Bottom 0.305: v167,6 167.47,6.47 167.57,6.57 167.57,9.31 166.24,10.63 166.24,10.75 166.22,10.78 U$65.10
N$1
  Bottom 0.305: D1.A 3.42,80.63 U$1.MX2
N$2
  Bottom 0.305: D2.A 22.52,80.61 U$2.MX2
N$3
  Bottom 0.305: U$3.MX2 54.03,90.49 54.03,83.09 D3.A
N$4
  Bottom 0.305: U$4.MX2 73.08,90.49 73.08,83.04 D4.A
N$5
  Bottom 0.305: U$5.MX2 92.13,90.49 92.13,83.09 D5.A
N$6
  Bottom 0.305: U$6.MX2 111.18,90.49 111.18,83.04 D6.A
N$7
  Bottom 0.305: U$7.MX2 130.23,90.49 130.23,82.99 D7.A
N$8
  Bottom 0.305: U$8.MX2 149.28,90.49 149.28,83.04 D8.A
N$9
  Bottom 0.305: D9.A 168.33,83.09 168.33,90.49 U$9.MX2
N$10
  Bottom 0.305: U$10.MX2 187.38,90.49 187.38,83.04 D10.A
N$11
  Bottom 0.305: U$11.MX2 206.43,90.49 206.43,82.99 D11.A
N$12
  Bottom 0.305: U$12.MX2 225.48,90.49 225.48,83.04 D12.A
N$13
  Bottom 0.305: U$13.MX2 244.53,90.49 244.53,82.99 D13.A
N$14
  Bottom 0.305: U$14.MX2 273.08,90.49 273.08,83.04 D14.A
N$15
  Bottom 0.305: U$15.MX2 20.7,71.44 20.7,64.01 D15.A
N$16
  Bottom 0.305: U$16.MX2 44.51,71.44 44.51,63.92 D16.A
N$17
  Bottom 0.305: U$17.MX2 63.56,71.44 63.56,63.97 D17.A
N$18
  Bottom 0.305: U$18.MX2 82.61,71.44 82.61,64.02 D18.A
N$19
  Bottom 0.305: U$19.MX2 101.66,71.44 101.66,63.97 D19.A
N$20
  Bottom 0.305: U$20.MX2 120.71,71.44 120.71,64.02 D20.A
N$21
  Bottom 0.152: U$21.MX2 139.58,71.51 | 139.58,63.89 D21.A
  Bottom 0.305: D21.A 139.58,63.89 139.73,64.04 139.73,71.36 139.58,71.51 U$21.MX2
N$22
  Bottom 0.305: U$22.MX2 158.81,71.44 158.81,64.02 D22.A
N$23
  Bottom 0.305: U$23.MX2 177.86,71.44 177.86,63.97 D23.A
N$24
  Bottom 0.305: U$24.MX2 196.91,71.44 196.91,64.02 D24.A
N$25
  Bottom 0.305: U$25.MX2 215.96,71.44 215.96,64.07 D25.A
N$26
  Bottom 0.305: U$26.MX2 235.01,71.44 235.01,64.02 D26.A
N$27
  Bottom 0.305: U$27.MX2 254.06,71.44 254.06,63.97 D27.A
N$28
  Bottom 0.305: U$28.MX2 277.87,71.44 277.87,63.98 D28.A
N$29
  Bottom 0.305: U$29.MX2 23.08,52.39 23.08,44.94 D29.A
N$30
  Bottom 0.305: U$30.MX2 49.27,52.39 49.27,44.93 D30.A
N$31
  Bottom 0.305: U$31.MX2 68.32,52.39 68.32,44.88 D31.A
N$32
  Bottom 0.305: U$32.MX2 87.37,52.39 87.37,44.93 D32.A
N$33
  Bottom 0.305: U$33.MX2 106.53,52.39 106.53,44.89 D33.A
N$34
  Bottom 0.305: U$34.MX2 125.47,52.39 125.47,44.93 D34.A
N$35
  Bottom 0.305: U$35.MX2 144.52,52.39 144.52,44.88 D35.A
N$36
  Bottom 0.305: U$36.MX2 163.57,52.39 163.57,44.93 D36.A
N$37
  Bottom 0.305: U$37.MX2 182.62,52.39 182.62,44.88 D37.A
N$38
  Bottom 0.305: U$38.MX2 201.67,52.39 201.67,44.93 D38.A
N$39
  Bottom 0.305: U$39.MX2 220.72,52.39 220.72,44.88 D39.A
N$40
  Bottom 0.305: U$40.MX2 239.77,52.39 239.77,44.93 D40.A
N$41
  Bottom 0.305: U$41.MX2 270.73,52.39 270.73,44.99 D41.A
N$42
  Bottom 0.305: U$42.MX2 27.84,33.34 27.84,25.95 D42.A
N$43
  Bottom 0.305: U$43.MX2 58.8,33.34 58.8,25.78 D43.A
N$44
  Bottom 0.305: U$44.MX2 77.85,33.34 77.85,25.96 D44.A
N$45
  Bottom 0.305: U$45.MX2 96.9,33.34 96.9,25.91 D45.A
N$46
  Bottom 0.305: U$46.MX2 115.95,33.34 115.95,25.78 D46.A
N$47
  Bottom 0.305: U$47.MX2 135,33.34 135,25.91 D47.A
N$48
  Bottom 0.305: U$48.MX2 154.05,33.34 154.05,25.78 D48.A
N$49
  Bottom 0.305: U$49.MX2 173.1,33.34 173.1,25.78 D49.A
N$50
  Bottom 0.305: U$50.MX2 192.15,33.34 192.15,25.96 D50.A
N$51
  Bottom 0.305: U$51.MX2 211.2,33.34 211.2,25.78 D51.A
N$52
  Bottom 0.305: U$52.MX2 237.09,33.66 238.45,32.3 238.45,27.14 237.04,25.73 D52.A
N$53
  Bottom 0.305: U$53.MX2 263.58,33.34 263.58,25.89 D53.A
N$54
  Bottom 0.305: U$54.MX2 282.29,33.66 279.98,31.34 279.98,25.74 D54.A
N$55
  Bottom 0.305: U$58.MX2 137.38,14.29 137.38,6.84 D58.A
N$56
  Bottom 0.305: U$55.MX2 18.32,14.29 18.32,6.88 D55.A
N$57
  Bottom 0.305: U$56.MX2 42.13,14.29 42.13,6.79 D56.A
N$58
  Bottom 0.305: U$57.MX2 65.94,14.29 65.94,6.7 D57.A
N$59  (via drill 0.35)
  Top 0.305: v11,91.25 14.5,91.25 v18.25,87.5
  Bottom 0.305: R4.2 10.75,91.5 v11,91.25 | v18.25,87.5 J1.2
N$60
  Bottom 0.305: U$59.MX2 206.43,14.29 206.43,6.89 D59.A
N$61
  Bottom 0.305: U$60.MX2 225.48,14.29 225.48,6.84 D60.A
N$62
  Bottom 0.305: D61.A 244.53,6.79 244.53,14.29 U$61.MX2
N$63
  Bottom 0.305: U$62.MX2 263.58,14.29 263.58,6.84 D62.A
N$64
  Bottom 0.305: U$63.MX2 282.29,14.61 279.98,12.29 279.98,6.69 D63.A
N$65  (via drill 0.35)
  Top 0.305: v19,87.5 22.75,91.25 v27,91.25
  Bottom 0.305: J1.3 19.05,87.55 v19,87.5 | R3.2 27.25,91.5 v27,91.25
N$66  (via drill 2.2 pad 4)
  other vias: 132,58
N$67  (via drill 2.2 pad 4)
  other vias: 25,68
N$68  (via drill 0.35)
  Top 0.305: v157.25,16 156.25,15 156.25,10.75 155.54,10.04 v150.04,10.04
  Bottom 0.305: U$65.33 157.57,15.68 v157.25,16 | v150.04,10.04 R2.2
N$69  (via drill 2.2 pad 4)
  other vias: 259,68
N$70  (via drill 2.2 pad 4)
  other vias: 95,11
N$71
  Bottom 0.305: C8.1 168.17,12.08 167.47,12.78 U$65.6
N$72  (via drill 2.2 pad 4)
  other vias: 5,45
N$73  (via drill 2.2 pad 4)
  other vias: 280.75,45
RESET  (via drill 0.35)
  Top 0.305: v164.75,9 165.1,9.35 168.82,9.35 171.72,12.25 v173.75,12.25
  Bottom 0.305: SV1.5 116.35,5.84 116.41,5.84 119.78,2.47 158.5,2.47 | U$65.13 162.92,8.83 163.25,8.5 163.25,7.21 158.5,2.47 | SW1.2 172.95,13.19 R1.1 174.9,12.89 174.25,12.25 v173.75,12.25 | 158.5,2.47 164.22,2.47 164.78,3.03 164.78,3.47 164.75,3.5 v164.75,9
ROW1  (via drill 0.35)
  Top 0.305: v277,81 v248,81 v229,81 v210,81 v191,81 v172,81 v153,81 v134,81 v115,81 v96,81 v77,81 v58,81 58,80 54,76 v27,76 v8,76
  Bottom 0.305: v58,81 56.94,82.06 D3.C | v77,81 76.03,81.97 D4.C | v96,81 95.03,81.97 D5.C | v115,81 114.14,81.86 D6.C | v134,81 133.24,81.77 D7.C | D8.C 152.24,81.77 v153,81 153,69.4 154.75,67.65 154.75,53.36 162.5,45.61 162.5,36.25 169.04,29.71 169.04,27.54 161.42,19.92 161.42,17.5 U$65.40 | v172,81 171.24,81.77 D9.C | v191,81 190.34,81.67 D10.C | v210,81 209.44,81.56 D11.C | v229,81 228.44,81.56 D12.C | v248,81 247.53,81.47 D13.C | v277,81 276.04,81.97 D14.C | D1.C 8,76.41 v8,76 | v27,76 25.79,77.22 D2.C
ROW2  (via drill 0.35)
  Top 0.305: v24,62 v48,62 v67,62 v86,62 v105,62 v124,62 v143,62 v162,62 v181,62 v200,62 v219,62 v239,62 v258,62 v282,62
  Bottom 0.305: D15.C 24,63.31 v24,62 | v48,62 47.53,62.47 D16.C | v67,62 66.53,62.47 D17.C | v86,62 85.53,62.47 D18.C | v105,62 104.64,62.37 D19.C | v124,62 123.64,62.37 D20.C | v143,62 142.63,62.37 D21.C | D22.C 161.74,62.27 v162,62 163.66,60.34 163.66,55.47 164.81,54.33 164.81,51.34 164,50.54 164,43.9 163,42.9 163,36.5 169.5,30 169.5,27.25 161.92,19.67 U$65.41 | v181,62 180.84,62.16 D23.C | v200,62 199.84,62.16 D24.C | v219,62 218.84,62.16 D25.C | v239,62 237.94,63.06 D26.C | v258,62 257.04,62.97 D27.C | v282,62 280.83,63.16 D28.C
ROW3  (via drill 0.35)
  Top 0.305: v27,43 v53,43 v72,43 v91,43 v110,43 v129,43 v148,43 v167,43 v186,43 v205,43 v224,43 v243,43 v274,43
  Bottom 0.305: D29.C 27,43.66 v27,43 | v53,43 52.23,43.77 D30.C | v72,43 71.33,43.66 D31.C | v91,43 90.33,43.66 D32.C | v110,43 109.53,43.47 D33.C | v129,43 128.44,43.56 D34.C | v148,43 147.53,43.47 D35.C | v167,43 166.53,43.47 D36.C 165.38,44.62 163.5,42.75 163.5,36.75 170,30.25 170,27 165.02,22.02 165.02,16.02 U$65.1 | v186,43 185.63,43.37 D37.C | v205,43 204.63,43.37 D38.C | v224,43 223.74,43.27 D39.C | v243,43 242.74,43.27 D40.C | v274,43 273.63,43.37 D41.C
ROW4  (via drill 0.35)
  Top 0.305: v32,24 v62,24 v81,24 v100,24 v120,24 v139,24 | v139,24 v158,24 v177,24 v196,24 v215,24 v241,24 v267,24 v284,24 | v140.81,17.5 140.81,17.56 142.75,19.5 142.75,21.75 140.5,24 v139,24
  Bottom 0.305: D42.C 32,24.31 v32,24 | v62,24 61.86,24.14 D43.C | v81,24 80.73,24.27 D44.C | v100,24 99.83,24.16 D45.C | v120,24 119.01,24.99 D46.C | v139,24 137.94,25.07 D47.C | v158,24 157.11,24.89 D48.C | v177,24 176.16,24.84 D49.C | v196,24 195.03,24.96 D50.C | v215,24 214.26,24.74 D51.C | v241,24 240.31,24.69 D52.C | v267,24 266.54,24.46 D53.C | v284,24 283.41,24.59 D54.C | U$65.32 142.59,14.78 140.71,16.65 140.71,17.4 v140.81,17.5
ROW5  (via drill 0.35)
  Top 0.305: v22,5 v46,5 v70,5 112.05,5 114.09,2.96 138.96,2.96 v141,5 143.5,2.5 163.5,2.5 v164.25,3.25 166.03,5.03 v210.25,5.03
  Bottom 0.305: D55.C 22,5.76 v22,5 | v46,5 45.13,5.87 D56.C | v70,5 69.03,5.96 D57.C | D58.C 141,5.86 v141,5 | U$65.12 164.17,8.68 164.17,3.33 v164.25,3.25 | D59.C 209.34,5.95 v210.25,5.03 228.97,5.03 | 228.97,5.03 229,5 229,5.96 D60.C | 228.97,5.03 248.22,5.03 | 248.22,5.03 248.25,5 248.25,5.81 D61.C | 248.22,5.03 267.22,5.03 | 267.22,5.03 267.22,5.84 D62.C | 267.22,5.03 281.92,5.03 D63.C
SCLK  (via drill 0.35)
  Top 0.305: SV1.4 116.56,9.73 122.41,3.89 139.14,3.89 140.78,5.53 141.22,5.53 141.53,5.22 141.53,5.15 143.75,2.93 163.18,2.93 165.71,5.46 167.5,5.46 168,5.96 v168,6.25
  Bottom 0.305: v168,6.25 168,9.49 166.68,10.81 166.68,11.07 166.47,11.28 U$65.9
XTAL1  (via drill 0.35)
  Top 0.305: v160.25,7.53 159.22,6.5 v153.75,6.5
  Bottom 0.305: C1.1 152.47,7.47 Y2.3 153.45,6.5 v153.75,6.5 | U$65.17 160.92,8.2 v160.25,7.53
XTAL2  (via drill 0.35)
  Top 0.305: v153.75,5.5 154.75,4.5 v158.03,4.5
  Bottom 0.305: U$65.16 161.42,7.92 160.5,7 159.25,7 158.25,6 158.25,5.75 C2.1 158.32,4.79 v158.03,4.5 | Y2.1 154.75,5.5 v153.75,5.5

### Text on the board
bPlace: USB-CON | C3 | C4 | C5 | C6 | C7 | GND | ATMEGA32U4 | MOSI | RESET | R1 | C8 | MISO | R2 | SCLK | C1 | RESET | 5V | Crystal | C2